# Altium schematic sheet opg_psu.SchDoc
size A4; SheetNumber: 4; SheetTotal: 6
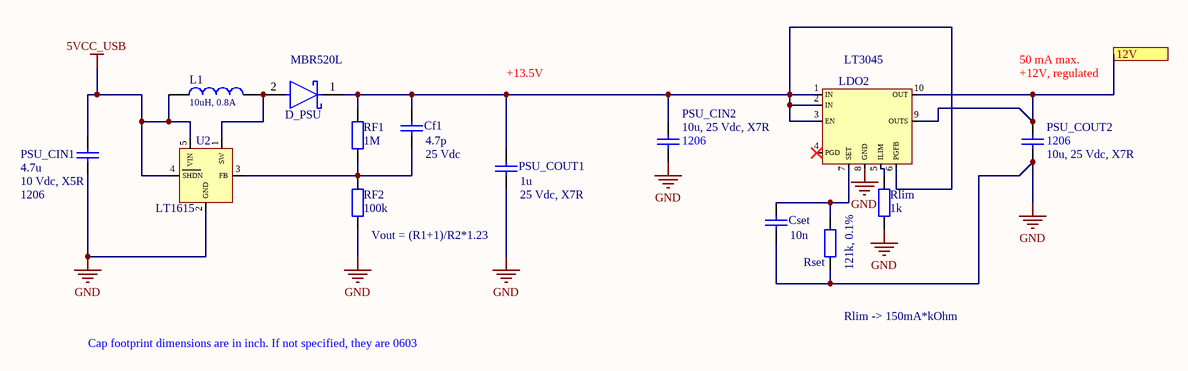
[diagram p0: opg_psu.SchDoc]

## Parts
Cf1  value 4.7p  [1608[0603]]
Cset  value 10n  [1608[0603]]
D_PSU  MBR0540T1G  [On_Semiconductor_425-04_MFG]  (value not drawn)
L1  10uH, 0.8A  [WE-PD2_3521]
LDO2  LT3045  [LT3045]
PSU_CIN1  value 4.7u  [C1206]
PSU_CIN2  value 10u, 25 Vdc, X7R  [C1206]
PSU_COUT1  value 1u  [1608[0603]]
PSU_COUT2  value 10u, 25 Vdc, X7R  [C1206]
RF1  1M  [WRIS-KSKE_0805]
RF2  100k  [WRIS-KSKE_0805]
Rlim  1k  [WRIS-KSKE_0805]
Rset  121k, 0.1%  [WRIS-KSKE_1206]
U2  LT1615  [LT1615]

## Ports
12V

## Nets
5VCC_USB: L1.1 PSU_CIN1.2 U2.4(SHDN) U2.5(VIN)
GND: Cset.1 LDO2.8(GND) PSU_CIN1.1 PSU_CIN2.1 PSU_COUT1.1 PSU_COUT2.1 RF2.1 Rlim.1 Rset.1 U2.2(GND)
12V: LDO2.9(OUTS) LDO2.10(OUT) PSU_COUT2.2 ; port 12V
NetCf1_1: Cf1.1 RF1.1 RF2.2 U2.3(FB)
NetCf1_2: Cf1.2 D_PSU.1(C) LDO2.1(IN) LDO2.2(IN) LDO2.3(EN) LDO2.6(PGFB) PSU_CIN2.2 PSU_COUT1.2 RF1.2
NetCset_2: Cset.2 LDO2.7(SET) Rset.2
NetD_PSU_2: D_PSU.2(A) L1.2 U2.1(SW)
NetLDO2_5: LDO2.5(ILIM) Rlim.2

Not connected (* = marked no-connect by the designer): LDO2 4(PGD)*

## Notes on the sheet
- (near D_PSU) MBR520L
- 50 mA max.
- +13.5V
- +12V, regulated
- (near PSU_CIN1) 10 Vdc, X5R
- (near PSU_CIN1) 1206
- (near Cf1) 25 Vdc
- (near PSU_COUT1) 25 Vdc, X7R
- (near PSU_CIN2) 1206
- (near PSU_COUT2) 1206
- (near RF2) Vout = (R1+1)/R2*1.23
- Rlim -> 150mA*kOhm
- Cap footprint dimensions are in inch. If not specified, they are 0603

## Library data of the parts
Cf1 Cset PSU_CIN1 PSU_CIN2 PSU_COUT1 PSU_COUT2 = Cap Semi: Capacitor (Semiconductor SIM Model); Published: 8-Jun-2000; LatestRevisionDate: 29-May-2009; LatestRevisionNote: IPC-7351 Footprint Added.; PackageReference: C1206; Publisher: Altium Limited; PackageDescription: Chip Capacitor
L1 = 7447732110: WE-PD2 SMT Power Inductor, size 3521, 10uH, 0.8A; Manufacturer: Wurth Elektronik; Self Resonant Frequency: 45MHz; DC Resistance max.: 0.3Ohm; DC Resistance typ.: 0.237Ohm; Saturation Current: 1.23A; ComponentLink1Description: Manufacturer; ComponentLink1URL: http://www.we-online.de; ComponentLink2Description: Datasheet; ComponentLink2URL: https://www.we-online.com/catalog/datasheet/7447732110.pdf; Packaging: Tape and Reel; Published Date: April 2020; Rated Current: 0.8A; Operating Temperature: -40 to +125degC; Size: 3521; Inductance: 10uH; Mounting Technology: SMT; Manufacturer Part Number: 7447732110
LDO2 = LT3045: 20V, 500mA, Ultralow Noise, Ultrahigh PSRR LDO
RF1 RF2 Rlim = 560050320001: WRIS-KSKE SMT Thick Film Resistor, size 0805, 0.1Ohm, 0.33W; Manufacturer: Wurth Elektronik; Rated Current: 1.81A; Temperature Coefficient of Resistance: 250ppm/degC; Technical Reference: KE0805R100F103LAATP0000; Resistance Tolerance: +/-1%; ComponentLink1Description: Manufacturer; ComponentLink1URL: http://www.we-online.de; ComponentLink2Description: Datasheet; ComponentLink2URL: https://www.we-online.com/catalog/datasheet/560050320001.pdf; Published Date: May 2020; Rated Power: 0.33W; Resistance: 0.1Ohm; Height: 0.6mm; Operating Temperature: -55 to +155degC; Mounting Technology: SMT; Packaging: Tape and Reel; Size: 0805; Length: 2mm; Manufacturer Part Number: 560050320001; Width: 1.25mm
Rset = 560050332001: WRIS-KSKE SMT Thick Film Resistor, size 1206, 0.05Ohm, 0.5W; Manufacturer: Wurth Elektronik; Rated Current: 3.16A; Temperature Coefficient of Resistance: 250ppm/degC; Technical Reference: KE1206R050F102LAATP0000; Resistance Tolerance: +/-1%; ComponentLink1Description: Manufacturer; ComponentLink1URL: http://www.we-online.de; ComponentLink2Description: Datasheet; ComponentLink2URL: https://www.we-online.com/catalog/datasheet/560050332001.pdf; Published Date: May 2020; Rated Power: 0.5W; Resistance: 0.05Ohm; Height: 0.6mm; Operating Temperature: -55 to +155degC; Mounting Technology: SMT; Packaging: Tape and Reel; Size: 1206; Length: 3.1mm; Manufacturer Part Number: 560050332001; Width: 1.6mm
U2 = LT1615: Micropower Step-up DC/DC Converter in ThinSOT